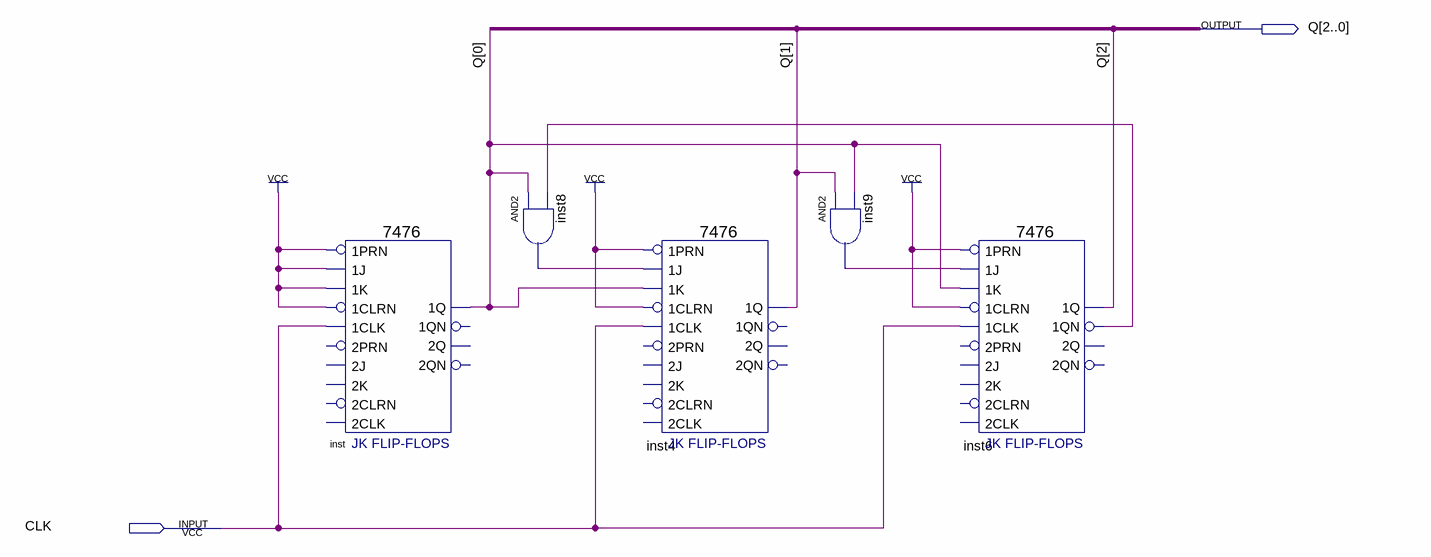
[diagram p0: schematic sheet]
// Quartus schematic SixCnt.bdf as structural Verilog: 5 symbols, 2 pins
module SixCnt (
  input  CLK,
  output [2:0] Q
);

  wire inst6_1qn, inst8_out, inst9_out;

  \7476  inst (
    .\1J (1'b1), .\1K (1'b1), .\1PRN (1'b1), .\1CLK (CLK), .\1CLRN (1'b1), .\1Q (Q[0]));  // open: 2PRN, 2J, 2K, 2CLRN, 2CLK, 2QN, 2Q, 1QN
  and inst8 (inst8_out, Q[0], inst6_1qn);
  \7476  inst4 (
    .\1J (inst8_out), .\1K (Q[0]), .\1PRN (1'b1), .\1CLK (CLK), .\1CLRN (1'b1), .\1Q (Q[1]));  // open: 2PRN, 2J, 2K, 2CLRN, 2CLK, 2QN, 2Q, 1QN
  and inst9 (inst9_out, Q[1], Q[0]);
  \7476  inst6 (
    .\1J (inst9_out), .\1K (Q[0]), .\1PRN (1'b1), .\1CLK (CLK), .\1CLRN (1'b1), .\1Q (Q[2]), .\1QN (inst6_1qn));  // open: 2PRN, 2J, 2K, 2CLRN, 2CLK, 2QN, 2Q
endmodule
